# Altium project momiu_01.PrjPcb
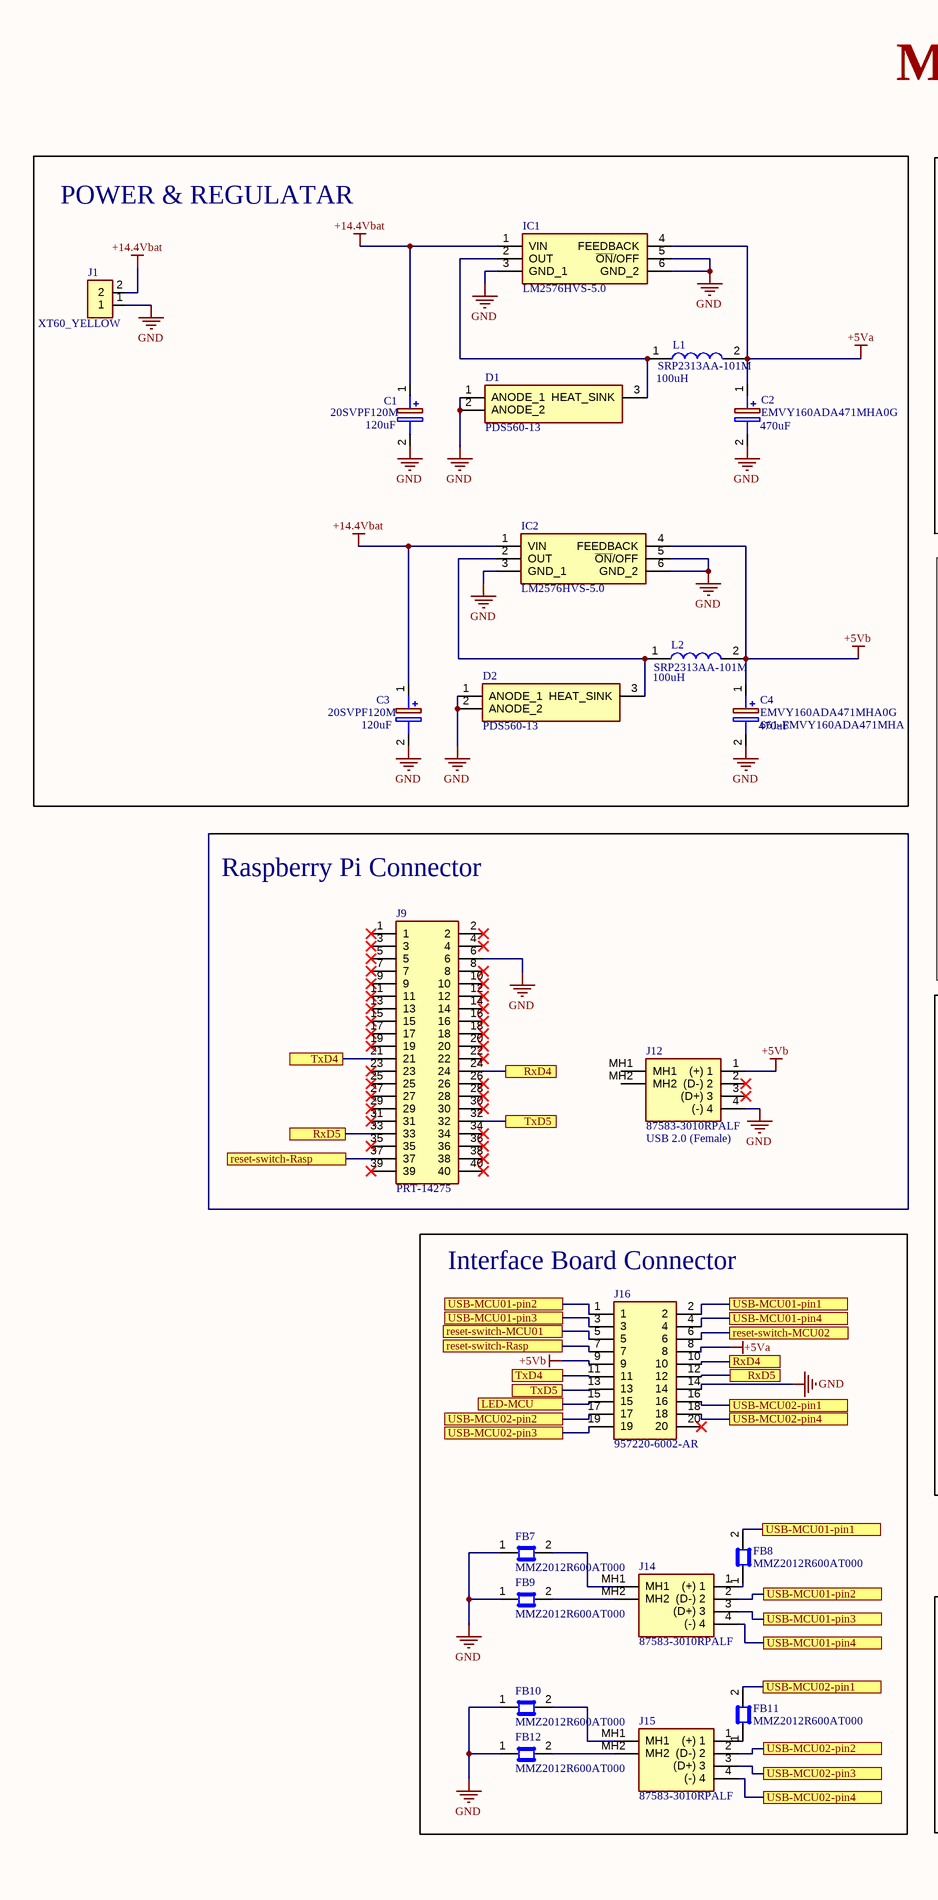
[diagram p0: [03] - MAIN BOARD MOMIU SCHEMATIC.SchDoc, left]
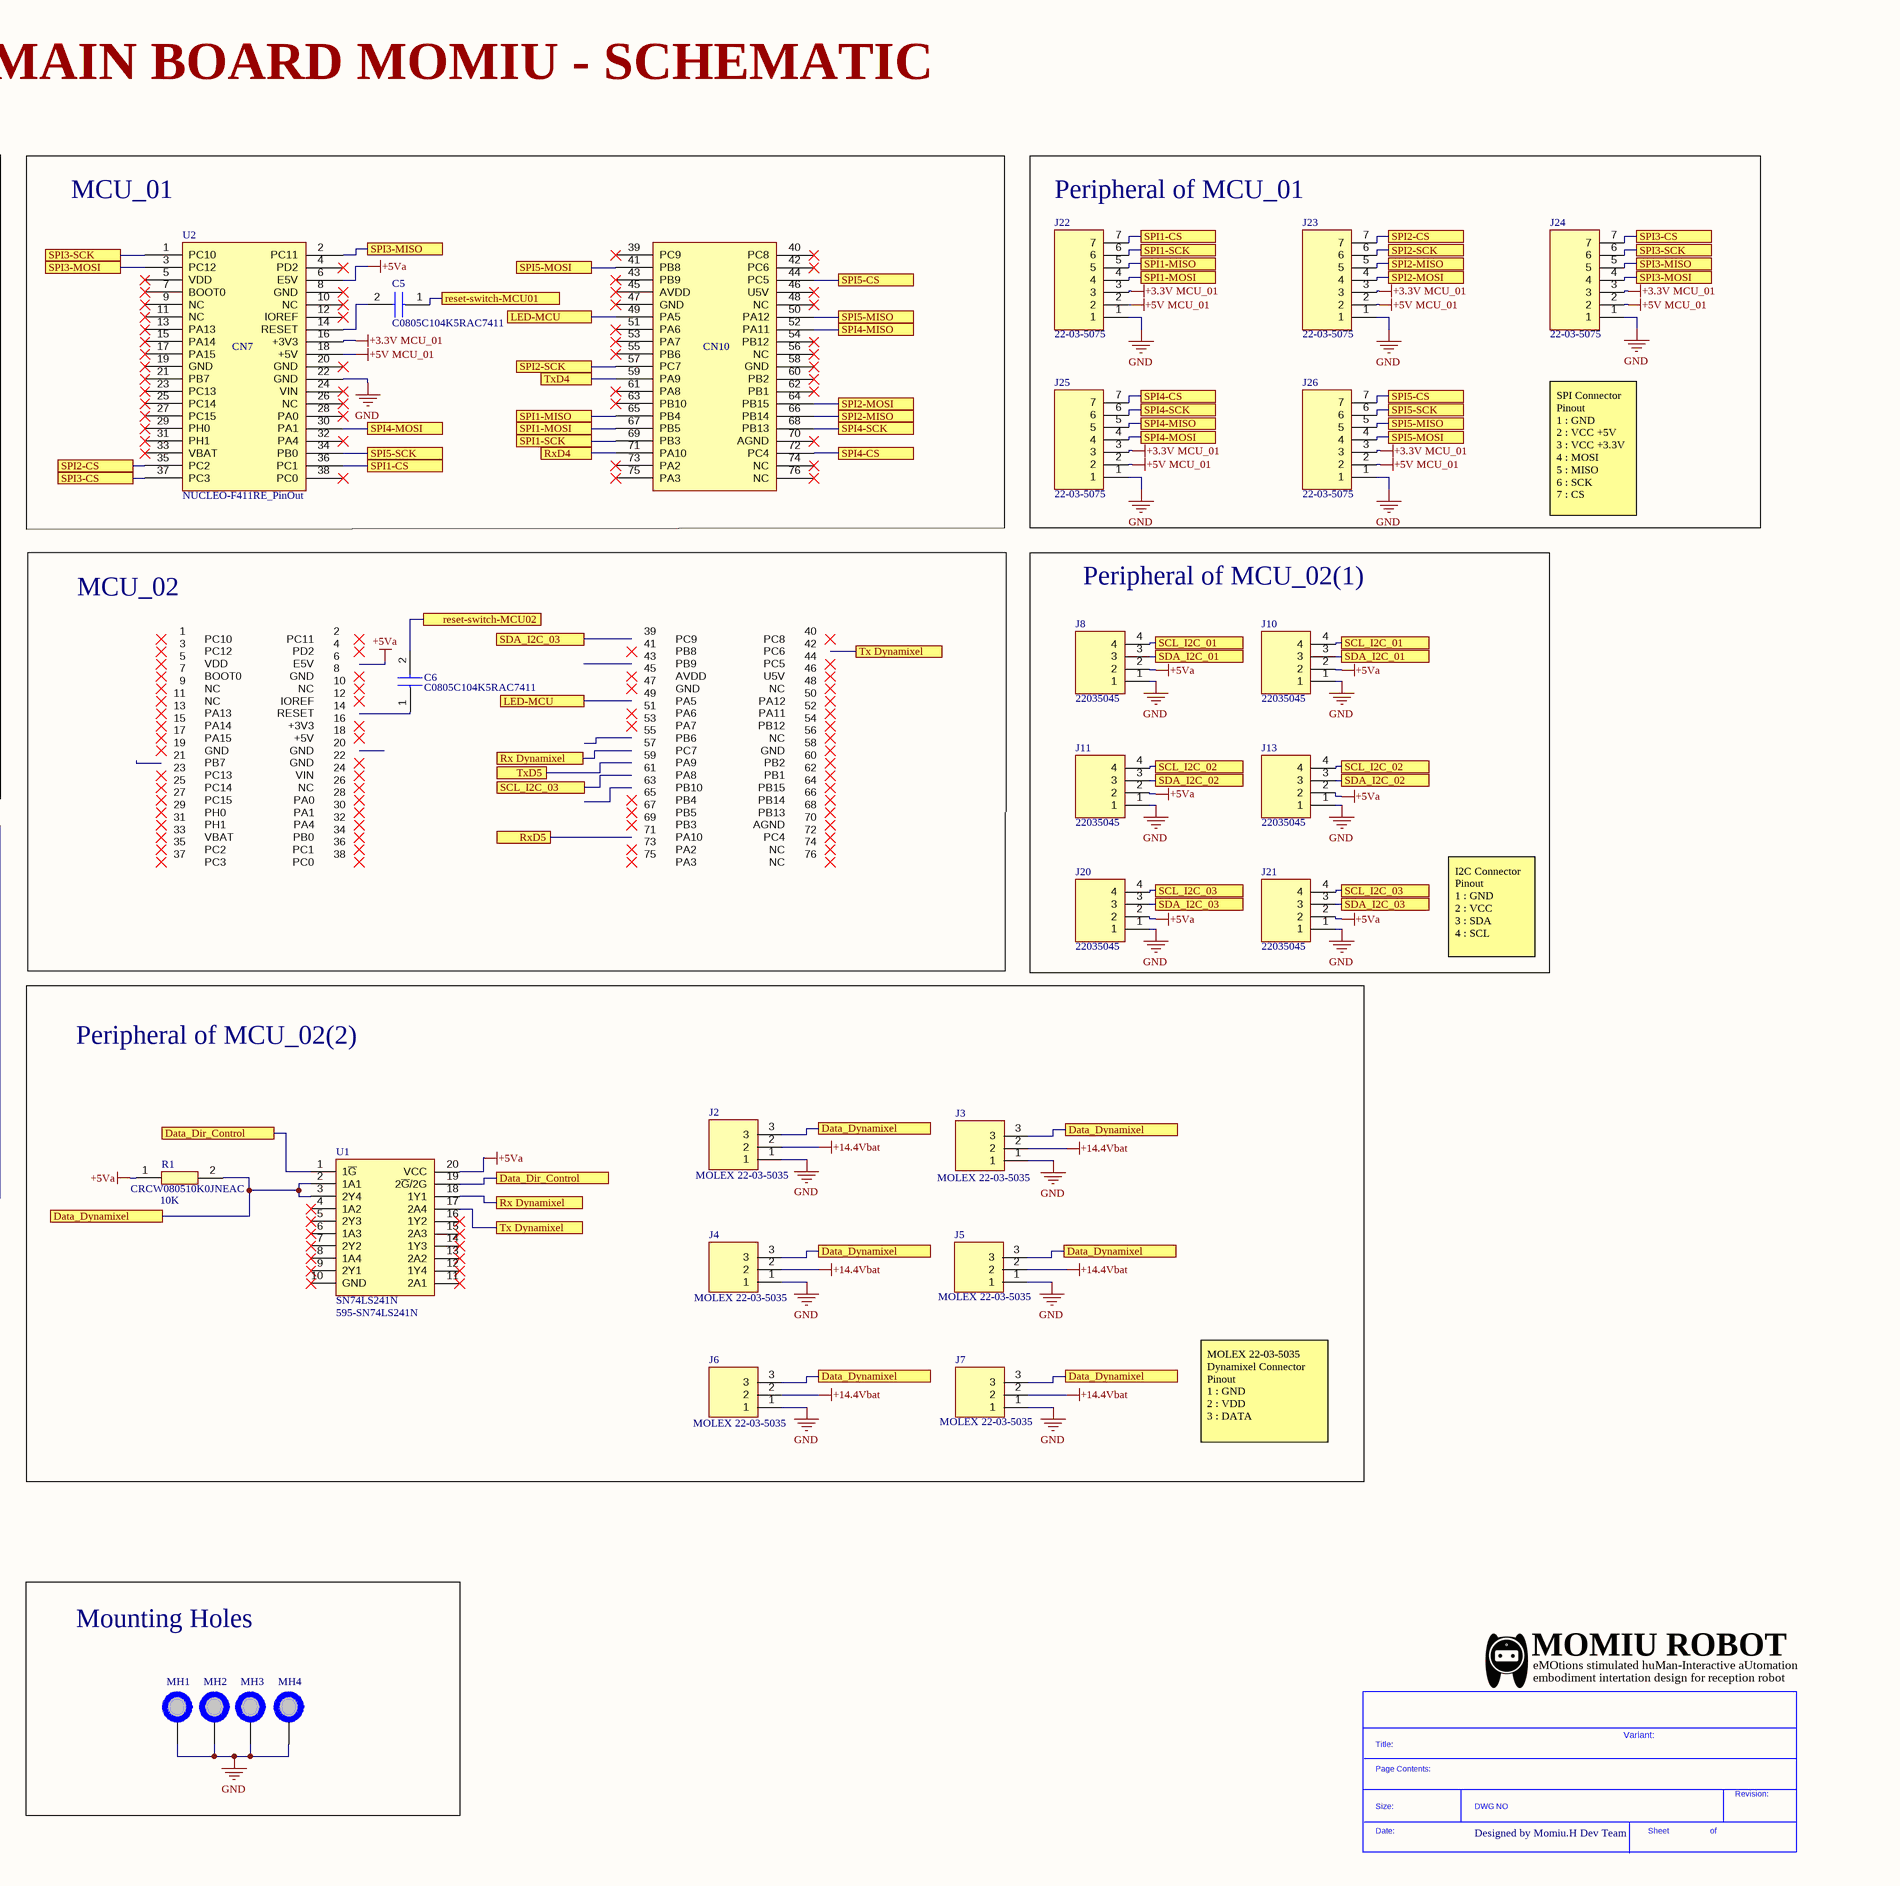
[diagram p1: [03] - MAIN BOARD MOMIU SCHEMATIC.SchDoc, right]
VersionRevision: V1; Title: MOMIU ROBOT-CIRCUIT; Size: -; Project: MOMIU ROBOT; DwgNoMomiu: 1; Company: (C) 2020 MOMIU.H Dev Team
1 sheet, 50 parts. Net scope: flat (ports and power ports of the same name join across sheets).
Board files: PCB_MAIN-BOARD-MOMIU.PcbDoc, PCB_INTERFACE-BOARD-MOMIU.PcbDoc

## Sheet [03] - MAIN BOARD MOMIU SCHEMATIC.SchDoc: MOMIU ROBOT-CIRCUIT
size A2; DocumentNumber: 3; SheetNumber: 3; SheetTotal: 6

### Parts
*?  SDTitleBlock  (value not drawn)  (graphical)
C1  20SVPF120M  [CAPAE660X600N]
C2  EMVY160ADA471MHA0G  [CAPAE830X1050N]
C3  20SVPF120M  [CAPAE660X600N]
C4  EMVY160ADA471MHA0G  Supplier Part Number 1: 661-EMVY160ADA471MHA  [CAPAE830X1050N]
C5  C0805C104K5RAC7411  [CAPC2012X88N]
C6  C0805C104K5RAC7411  [CAPC2012X88N]
D1  PDS560-13  [POWERDI5]
D2  PDS560-13  [POWERDI5]
FB7  MMZ2012R600AT000  [CAPC2012X100N]
FB8  MMZ2012R600AT000  [CAPC2012X100N]
FB9  MMZ2012R600AT000  [CAPC2012X100N]
FB10  MMZ2012R600AT000  [CAPC2012X100N]
FB11  MMZ2012R600AT000  [CAPC2012X100N]
FB12  MMZ2012R600AT000  [CAPC2012X100N]
IC1  LM2576HVS-5.0  [KTT0005B]
IC2  LM2576HVS-5.0  [KTT0005B]
J1  XT60_YELLOW  [AMASS_XT60PB-M]
J2  MOLEX 22-03-5035  [SHDR3W60P0X250_1X3_990X490X590P]
J3  MOLEX 22-03-5035  [SHDR3W60P0X250_1X3_990X490X590P]
J4  MOLEX 22-03-5035  [SHDR3W60P0X250_1X3_990X490X590P]
J5  MOLEX 22-03-5035  [SHDR3W60P0X250_1X3_990X490X590P]
J6  MOLEX 22-03-5035  [SHDR3W60P0X250_1X3_990X490X590P]
J7  MOLEX 22-03-5035  [SHDR3W60P0X250_1X3_990X490X590P]
J8  22035045  [SHDR4W70P0X250_1X4_1240X490X610P]
J9  PRT-14275  [HDRV40W64P254_2X20_5080X500X884P]
J10  22035045  [SHDR4W70P0X250_1X4_1240X490X610P]
J11  22035045  [SHDR4W70P0X250_1X4_1240X490X610P]
J12  87583-3010RPALF  [875833010RPALF]
J13  22035045  [SHDR4W70P0X250_1X4_1240X490X610P]
J14  87583-3010RPALF  [875833010RPALF]
J15  87583-3010RPALF  [875833010RPALF]
J16  957220-6002-AR  [9572206002AR]
J20  22035045  [SHDR4W70P0X250_1X4_1240X490X610P]
J21  22035045  [SHDR4W70P0X250_1X4_1240X490X610P]
J22  22-03-5075  [SHDR7W70P0X250_1X7_1990X490X590P]
J23  22-03-5075  [SHDR7W70P0X250_1X7_1990X490X590P]
J24  22-03-5075  [SHDR7W70P0X250_1X7_1990X490X590P]
J25  22-03-5075  [SHDR7W70P0X250_1X7_1990X490X590P]
J26  22-03-5075  [SHDR7W70P0X250_1X7_1990X490X590P]
L1  SRP2313AA-101M  [INDPM235220X1300N]
L2  SRP2313AA-101M  [INDPM235220X1300N]
MH1  MH_7.4 MMC_3.2 MMD  [MH_7.4 MMC_3.2 MMD]  (value not drawn)  (no BOM)
MH2  MH_7.4 MMC_3.2 MMD  [MH_7.4 MMC_3.2 MMD]  (value not drawn)  (no BOM)
MH3  MH_7.4 MMC_3.2 MMD  [MH_7.4 MMC_3.2 MMD]  (value not drawn)  (no BOM)
MH4  MH_7.4 MMC_3.2 MMD  [MH_7.4 MMC_3.2 MMD]  (value not drawn)  (no BOM)
R1  CRCW080510K0JNEAC  [RESC2012X60N]
U1  SN74LS241N  Supplier Part Number 1: 595-SN74LS241N  [DIP794W53P254L2540H508Q20N]
U2  NUCLEO-F411RE_PinOut  [ST_NUCLEO-F411RE]
U3  NUCLEO-F411RE_PinOut  [ST_NUCLEO-F411RE]

### Blocks framed on the sheet
POWER & REGULATAR: C1-C4 D1 D2 IC1 IC2 J1 L1 L2
MCU_01: C5 U2
Peripheral of MCU_01: J22-J26
Peripheral of MCU_02(1): J8 J10 J11 J13 J20 J21
Peripheral of MCU_02(2): J2-J7 R1 U1
Interface Board Connector: FB7-FB12 J14-J16
Mounting Holes: MH1-MH4

### Ports
Data_Dir_Control, Data_Dynamixel, LED-MCU, reset-switch-MCU01, reset-switch-MCU02, reset-switch-Rasp, Rx Dynamixel, RxD4, RxD5, SCL_I2C_01, SCL_I2C_02, SCL_I2C_03, SDA_I2C_01, SDA_I2C_02, SDA_I2C_03, SPI1-CS, SPI1-MISO, SPI1-MOSI, SPI1-SCK, SPI2-CS, SPI2-MISO, SPI2-MOSI, SPI2-SCK, SPI3-CS, SPI3-MISO, SPI3-MOSI, SPI3-SCK, SPI4-CS, SPI4-MISO, SPI4-MOSI, SPI4-SCK, SPI5-CS, SPI5-MISO, SPI5-MOSI, SPI5-SCK, Tx Dynamixel, TxD4, TxD5, USB-MCU01-pin1, USB-MCU01-pin2, USB-MCU01-pin3, USB-MCU01-pin4, USB-MCU02-pin1, USB-MCU02-pin2, USB-MCU02-pin3, USB-MCU02-pin4

### Nets
+3.3V MCU_01: J22.3 J23.3 J24.3 J25.3 J26.3 U2.16(+3V3)
+5V MCU_01: J22.2 J23.2 J24.2 J25.2 J26.2 U2.18(+5V)
+5Va: C2.1(+) IC1.4(FEEDBACK) J8.2 J10.2 J11.2 J13.2 J16.8 J20.2 J21.2 L1.2 R1.1 U1.20(VCC) U2.6(E5V) U3.6(E5V)
+5Vb: C4.1(+) IC2.4(FEEDBACK) J12.1((+)_1) J16.9 L2.2
+14.4Vbat: C1.1(+) C3.1(+) IC1.1(VIN) IC2.1(VIN) J1.2 J2.2 J3.2 J4.2 J5.2 J6.2 J7.2
GND: C1.2(-) C2.2(-) C3.2(-) C4.2(-) D1.1(ANODE_1) D1.2(ANODE_2) D2.1(ANODE_1) D2.2(ANODE_2) FB7.1 FB9.1 FB10.1 FB12.1 IC1.3(GND_1) IC1.5(~{ON}/OFF) IC1.6(GND_2) IC2.3(GND_1) IC2.5(~{ON}/OFF) IC2.6(GND_2) J1.1 J2.1 J3.1 J4.1 J5.1 J6.1 J7.1 J8.1 J9.6 J10.1 J11.1 J12.4((-)_4) J13.1 J16.14 J20.1 J21.1 J22.1 J23.1 J24.1 J25.1 J26.1 MH1.1 MH2.1 MH3.1 MH4.1 U2.22(GND) U3.20(GND)
NetC5_1: C5.1 J16.5 ; port reset-switch-MCU01
NetC5_2: C5.2 U2.14(RESET)
NetC6_1: C6.1 U3.14(RESET)
NetC6_2: C6.2 J16.6 ; port reset-switch-MCU02
NetD1_3: D1.3(HEAT_SINK) IC1.2(OUT) L1.1
NetD2_3: D2.3(HEAT_SINK) IC2.2(OUT) L2.1
NetFB7_2: FB7.2 J14.MH1
NetFB8_1: FB8.1 J14.1((+)_1)
NetFB8_2: FB8.2 J16.2 ; port USB-MCU01-pin1
NetFB9_2: FB9.2 J14.MH2
NetFB10_2: FB10.2 J15.MH1
NetFB11_1: FB11.1 J15.1((+)_1)
NetFB11_2: FB11.2 J16.16 ; port USB-MCU02-pin1
NetFB12_2: FB12.2 J15.MH2
NetJ2_3: J2.3 J3.3 J4.3 J5.3 J6.3 J7.3 R1.2 U1.2(1A1) U1.3(2Y4) ; port Data_Dynamixel
NetJ8_3: J8.3 J10.3 U3.21(PB7) ; port SDA_I2C_01
NetJ8_4: J8.4 J10.4 U3.55(PB6) ; port SCL_I2C_01
NetJ9_21: J9.21 J16.11 U2.59(PA9) ; port TxD4
NetJ9_24: J9.24 J16.10 U2.71(PA10) ; port RxD4
NetJ9_32: J9.32 J16.13 U3.59(PA9) ; port TxD5
NetJ9_33: J9.33 J16.12 U3.71(PA10) ; port RxD5
NetJ9_37: J9.37 J16.7 ; port reset-switch-Rasp
NetJ11_3: J11.3 J13.3 U3.43(PB9) ; port SDA_I2C_02
NetJ11_4: J11.4 J13.4 U3.63(PB10) ; port SCL_I2C_02
NetJ14_2: J14.2((D-)_2) J16.1 ; port USB-MCU01-pin2
NetJ14_3: J14.3((D+)_3) J16.3 ; port USB-MCU01-pin3
NetJ14_4: J14.4((-)_4) J16.4 ; port USB-MCU01-pin4
NetJ15_2: J15.2((D-)_2) J16.17 ; port USB-MCU02-pin2
NetJ15_3: J15.3((D+)_3) J16.19 ; port USB-MCU02-pin3
NetJ15_4: J15.4((-)_4) J16.18 ; port USB-MCU02-pin4
NetJ16_15: J16.15 U2.49(PA5) U3.49(PA5) ; port LED-MCU
NetJ20_3: J20.3 J21.3 U3.39(PC9) ; port SDA_I2C_03
NetJ20_4: J20.4 J21.4 U3.61(PA8) ; port SCL_I2C_03
NetJ22_4: J22.4 U2.67(PB5) ; port SPI1-MOSI
NetJ22_5: J22.5 U2.65(PB4) ; port SPI1-MISO
NetJ22_6: J22.6 U2.69(PB3) ; port SPI1-SCK
NetJ22_7: J22.7 U2.36(PC1) ; port SPI1-CS
NetJ23_4: J23.4 U2.64(PB15) ; port SPI2-MOSI
NetJ23_5: J23.5 U2.66(PB14) ; port SPI2-MISO
NetJ23_6: J23.6 U2.57(PC7) ; port SPI2-SCK
NetJ23_7: J23.7 U2.35(PC2) ; port SPI2-CS
NetJ24_4: J24.4 U2.3(PC12) ; port SPI3-MOSI
NetJ24_5: J24.5 U2.2(PC11) ; port SPI3-MISO
NetJ24_6: J24.6 U2.1(PC10) ; port SPI3-SCK
NetJ24_7: J24.7 U2.37(PC3) ; port SPI3-CS
NetJ25_4: J25.4 U2.30(PA1) ; port SPI4-MOSI
NetJ25_5: J25.5 U2.52(PA11) ; port SPI4-MISO
NetJ25_6: J25.6 U2.68(PB13) ; port SPI4-SCK
NetJ25_7: J25.7 U2.72(PC4) ; port SPI4-CS
NetJ26_4: J26.4 U2.41(PB8) ; port SPI5-MOSI
NetJ26_5: J26.5 U2.50(PA12) ; port SPI5-MISO
NetJ26_6: J26.6 U2.34(PB0) ; port SPI5-SCK
NetJ26_7: J26.7 U2.44(PC5) ; port SPI5-CS
NetU1_1: U1.1(1~{G}) U1.19(2~{G}/2G) ; port Data_Dir_Control
NetU1_17: U1.17(2A4) U3.42(PC6) ; port Tx Dynamixel
NetU1_18: U1.18(1Y1) U3.57(PC7) ; port Rx Dynamixel

Not connected (* = marked no-connect by the designer): J9 1* 2* 3* 4* 5* 7* 8* 9* 10* 11* 12* 13* 14* 15* 16* 17* 18* 19* 20* 22* 23* 25* 26* 27* 28* 29* 30* 31* 34* 35* 36* 38* 39* 40*; J12 2((D-)_2)* 3((D+)_3)* MH1 MH2; J16 20*; U1 4(1A2)* 5(2Y3)* 6(1A3)* 7(2Y2)* 8(1A4)* 9(2Y1)* 10(GND)* 11(2A1)* 12(1Y4)* 13(2A2)* 14(1Y3)* 15(2A3)* 16(1Y2)*; U2 4(PD2)* 5(VDD)* 7(BOOT0)* 8(GND)* 9(NC)* 10(NC)* 11(NC)* 12(IOREF)* 13(PA13)* 15(PA14)* 17(PA15)* 19(GND)* 20(GND)* 21(PB7)* 23(PC13)* 24(VIN)* 25(PC14)* 26(NC)* 27(PC15)* 28(PA0)* 29(PH0)* 31(PH1)* 32(PA4)* 33(VBAT)* 38(PC0)* 39(PC9)* 40(PC8)* 42(PC6)* 43(PB9)* 45(AVDD)* 46(U5V)* 47(GND)* 48(NC)* 51(PA6)* 53(PA7)* 54(PB12)* 55(PB6)* 56(NC)* 58(GND)* 60(PB2)* 61(PA8)* 62(PB1)* 63(PB10)* 70(AGND)* 73(PA2)* 74(NC)* 75(PA3)* 76(NC)*; U3 1(PC10)* 2(PC11)* 3(PC12)* 4(PD2)* 5(VDD)* 7(BOOT0)* 8(GND)* 9(NC)* 10(NC)* 11(NC)* 12(IOREF)* 13(PA13)* 15(PA14)* 16(+3V3)* 17(PA15)* 18(+5V)* 19(GND)* 22(GND)* 23(PC13)* 24(VIN)* 25(PC14)* 26(NC)* 27(PC15)* 28(PA0)* 29(PH0)* 30(PA1)* 31(PH1)* 32(PA4)* 33(VBAT)* 34(PB0)* 35(PC2)* 36(PC1)* 37(PC3)* 38(PC0)* 40(PC8)* 41(PB8)* 44(PC5)* 45(AVDD)* 46(U5V)* 47(GND)* 48(NC)* 50(PA12)* 51(PA6)* 52(PA11)* 53(PA7)* 54(PB12)* 56(NC)* 58(GND)* 60(PB2)* 62(PB1)* 64(PB15)* 65(PB4)* 66(PB14)* 67(PB5)* 68(PB13)* 69(PB3)* 70(AGND)* 72(PC4)* 73(PA2)* 74(NC)* 75(PA3)* 76(NC)*

### Notes on the sheet
- MAIN BOARD MOMIU - SCHEMATIC
- (near C1) 120uF
- (near L1) 100uH
- (near C2) 470uF
- SPI Connector                                                      Pinout                                                                 1 : GND                                                              2 : VCC +5V                                                           3 : VCC +3.3V                                                         4 : MOSI                                                                  5 : MISO                                                                   6 : SCK                                                                   7 : CS
- MCU_02
- (near L2) 100uH
- (near C3) 120uF
- (near C4) 470uF
- Raspberry Pi Connector
- I2C Connector                                                      Pinout                                                                 1 : GND                                                              2 : VCC                                                            3 : SDA                                                               4 : SCL
- (near J12) USB 2.0 (Female)
- (near R1) 10K
- MOLEX 22-03-5035                                         Dynamixel Connector                                        Pinout                                                                  1 : GND                                                                2 : VDD                                                               3 : DATA
- MOMIU ROBOT
- eMOtions stimulated huMan-Interactive aUtomation
- embodiment intertation design for reception robot
- Variant:
- Designed by Momiu.H Dev Team
- DWG NO:
- REV:
- THIS DOCUMENT AND THE DATA DISCLOSED HEREIN OR
- HEREWITH IS THE PROPERTY OF ALTIUM LIMITED AND MAY
- BE FREELY DISTRIBUTED IN WHOLE. NO RIGHTS ARE
- RESERVED OR EXPRESS OR IMPLIED WARANTEE GIVEN.
- REVISION
- DESCRIPTION
- DATE
- APPROVED
- ENG:
- APPROVALS
- PROJECT
- DSN:
- CHK:
- REFERENCE DOCUMENTS
- PROJECT REVISION:
- TITLE
- DOCUMENT REVISION:
- DESIGN ITEM:
- BOM:
- FAB DWG:
- PCB DWG:
- ASSY DWG:
- SCALE:
- A2
- SIZE
- CAGE CODE
- FILE NAME
- DWG NO.
- SHEET
- OF
- REV
- (in symbol NUCLEO-F411RE_MyVer) CN7; CN10
- (in symbol SDTitleBlock) Title:; Page Contents:; Revision:; Size:; DWG NO; Date:; Sheet; of

### Library data of the parts
C1 C3 = 20SVPF120M: Capacitor Polarised; Manufacturer_Name: Panasonic; Datasheet Link: https://industrial.panasonic.com/cdbs/www-data/pdf/AAB8000/AAB8000C177.pdf; Height: 6mm; Manufacturer_Part_Number: 20SVPF120M; Mouser Part Number: 667-20SVPF120M; Mouser Price/Stock: https://www.mouser.co.uk/ProductDetail/Panasonic/20SVPF120M/?qs=OE1iw1LrrPFAGQZp2uLmXQ%3D%3D; Arrow Part Number: 20SVPF120M; Arrow Price/Stock: https://www.arrow.com/en/products/20svpf120m/panasonic; Supplier 1: Mouser; Supplier Part Number 1: 667-20SVPF120M
C2 C4 = EMVY160ADA471MHA0G: Capacitor Polarised; Manufacturer_Name: United Chemi-Con; Datasheet Link: https://componentsearchengine.com/Datasheets/1/EMVY160ADA471MHA0G.pdf; Height: 10.5mm; Manufacturer_Part_Number: EMVY160ADA471MHA0G; Mouser Part Number: 661-EMVY160ADA471MHA; Mouser Price/Stock: https://www.mouser.com/Search/Refine.aspx?Keyword=661-EMVY160ADA471MHA; Arrow Part Number: EMVY160ADA471MHA0G; Arrow Price/Stock: https://www.arrow.com/en/products/emvy160ada471mha0g/united-chemi-con; Supplier 1: Mouser
  C2: Supplier Part Number 1: 661-EMVY160ADA471MHA
C5 C6 = C0805C104K5RAC7411: Capacitor; Manufacturer_Name: Kemet; Datasheet Link: https://www.mouser.com/datasheet/2/212/KEM_C1002_X7R_SMD-1102033.pdf; Height: 0.88mm; Manufacturer_Part_Number: C0805C104K5RAC7411; Mouser Part Number: 80-C0805C104K5RACLR; Mouser Price/Stock: https://www.mouser.co.uk/ProductDetail/KEMET/C0805C104K5RAC7411?qs=jbRM9o5BbzPcVXF0wW9AYg%3D%3D; Arrow Part Number: C0805C104K5RAC7411; Arrow Price/Stock: https://www.arrow.com/en/products/c0805c104k5rac7411/kemet-corporation; Supplier 1: Mouser; Supplier Part Number 1: 80-C0805C104K5RACLR
D1 D2 = PDS560-13: Diode; Manufacturer_Name: Diodes Inc.; Datasheet Link: http://uk.rs-online.com/web/p/products/7514685; Manufacturer_Part_Number: PDS560-13; Mouser Part Number: 621-PDS560-F; Mouser Price/Stock: https://www.mouser.co.uk/ProductDetail/Diodes-Incorporated/PDS560-13?qs=%2FNF5U5UGuWkl3I91y%252BsKBg%3D%3D; Arrow Part Number: PDS560-13; Arrow Price/Stock: https://www.arrow.com/en/products/pds560-13/diodes-incorporated; Supplier 1: Mouser; Supplier Part Number 1: 621-PDS560-F
FB7-FB12 = MMZ2012R600AT000: Ferrite Beads 60 OHM 25% @100 MHz; Supplier 1: Mouser; Supplier Part Number 1: 810-MMZ2012R600AT000
IC1 IC2 = LM2576HVS-5.0: Integrated Circuit; Manufacturer_Name: Texas Instruments; Datasheet Link: https://www.arrow.com/en/products/lm2576hvs-5.0/texas-instruments; Manufacturer_Part_Number: LM2576HVS-5.0; Mouser Part Number: 926-LM2576HVS-50; Mouser Price/Stock: https://www.mouser.co.uk/ProductDetail/Texas-Instruments/LM2576HVS-50/?qs=X1J7HmVL2ZGtvFS7GBfMMQ%3D%3D; Arrow Part Number: LM2576HVS-5.0; Arrow Price/Stock: https://www.arrow.com/en/products/lm2576hvs-5.0/texas-instruments; Supplier 1: Mouser; Supplier Part Number 1: 926-LM2576HVS5.0NOPB
J1 = XT60_YELLOW: Power connector; 65A; PIN: 2; Colour: yellow; MP: XT60 YELLOW; MF: Pololu; Package: None; SnapEDA_Link: https://www.snapeda.com/parts/XT60%20YELLOW/Pololu/view-part/423230/?ref=snap; Availability: Unavailable; Price: None; Value: *
J2-J7 = 22-03-5035: Connector; Datasheet Link: http://www.molex.com/pdm_docs/sd/022035035_sd.pdf; Height: 5.9mm; Manufacturer_Name: Molex; Manufacturer_Part_Number: 22-03-5035; Mouser Part Number: 538-22-03-5035; Mouser Price/Stock: https://www.mouser.co.uk/ProductDetail/Molex/22-03-5035?qs=VKrXD49J9Ep%252Bv2WwbOoiPA%3D%3D; Supplier 1: Mouser; Supplier Part Number 1: 538-22-03-5035
J8 J10 J11 J13 J20 J21 = 22035045: Connector; Manufacturer_Name: Molex; Datasheet Link: https://www.molex.com/pdm_docs/sd/022035045_sd.pdf; Height: 6.1mm; Manufacturer_Part_Number: 22035045; Arrow Part Number: 22035045; Arrow Price/Stock: http://www.arrow.com/en/products/22035045/molex; Supplier 1: Mouser; Supplier Part Number 1: 538-22-03-5045
J9 = PRT-14275: Connector; Manufacturer_Name: SparkFun; Datasheet Link: https://componentsearchengine.com/Datasheets/1/PRT-14275.pdf; Height: 8.84mm; Manufacturer_Part_Number: PRT-14275; Mouser Part Number: 474-PRT-14275; Mouser Price/Stock: https://www.mouser.co.uk/ProductDetail/SparkFun/PRT-14275/?qs=YCa%2FAAYMW01SLG%2FRsDUFug%3D%3D; Arrow Part Number: PRT-14275; Arrow Price/Stock: https://www.arrow.com/en/products/prt-14275/sparkfun-electronics; Supplier 1: Mouser; Supplier Part Number 1: 474-PRT-14275
J12 J14 J15 = 87583-3010RPALF: Connector; Manufacturer_Name: Amphenol; Datasheet Link: https://cdn.amphenol-icc.com/media/wysiwyg/files/drawing/87583.pdf; Height: 8.12mm; Manufacturer_Part_Number: 87583-3010RPALF; Mouser Part Number: 649-87583-3010RPALF; Mouser Price/Stock: https://www.mouser.co.uk/ProductDetail/Amphenol-FCI/87583-3010RPALF/?qs=nBv%252BRDKgYU12SV7JkWVR7Q%3D%3D; Arrow Part Number: 87583-3010RPALF; Arrow Price/Stock: https://www.arrow.com/en/products/87583-3010rpalf/amphenol-fci; Supplier 1: Mouser; Supplier Part Number 1: 649-87583-3010RPALF
J16 = 957220-6002-AR: Connector; Manufacturer_Name: 3M; Datasheet Link: http://multimedia.3m.com/mws/media/1400507O/3m-box-header-957-series-78-5100-2656-6.pdf; Height: 5.8mm; Manufacturer_Part_Number: 957220-6002-AR; Mouser Part Number: 517-957220-6002-AR; Mouser Price/Stock: https://www.mouser.co.uk/ProductDetail/3M-Electronic-Solutions-Division/957220-6002-AR?qs=g1avbHDutKUCo0RviEjKSg%3D%3D; Arrow Part Number: 957220-6002-AR; Arrow Price/Stock: https://www.arrow.com/en/products/957220-6002-ar/3m; Supplier 1: Mouser; Supplier Part Number 1: 517-957220-6002-AR
J22-J26 = 22-03-5075: Connector; Manufacturer_Name: Molex; Datasheet Link: https://componentsearchengine.com/Datasheets/1/22-03-5075.pdf; Height: 5.9mm; Manufacturer_Part_Number: 22-03-5075; Mouser Part Number: 538-22-03-5075; Mouser Price/Stock: https://www.mouser.co.uk/ProductDetail/Molex/22-03-5075?qs=4hg9R9g9MDvXfItj0edHKA%3D%3D; Supplier 1: Mouser; Supplier Part Number 1: 538-22-03-5075
L1 L2 = SRP2313AA-101M: Inductor; Manufacturer_Name: Bourns; Datasheet Link: https://th.mouser.com/datasheet/2/54/srp2313aa-1391616.pdf; Height: 13mm; Manufacturer_Part_Number: SRP2313AA-101M; Mouser Part Number: 652-SRP2313AA-101M; Mouser Price/Stock: https://www.mouser.co.uk/ProductDetail/Bourns/SRP2313AA-101M?qs=gZXFycFWdANfITbqx%252BPtOw%3D%3D; Arrow Part Number: SRP2313AA-101M; Arrow Price/Stock: https://www.arrow.com/en/products/srp2313aa-101m/bourns; Supplier 1: Mouser; Supplier Part Number 1: 652-SRP2313AA-330M
MH1-MH4 = MH_7.4MMC_3.2MMD: Mounting Hole 7.4mm Diameter, 3.2mm Drill
R1 = CRCW080510K0JNEAC: Resistor; Manufacturer_Name: Vishay; Datasheet Link: https://componentsearchengine.com/Datasheets/1/CRCW080510K0JNEAC.pdf; Height: 0.6mm; Manufacturer_Part_Number: CRCW080510K0JNEAC; Mouser Part Number: 71-CRCW080510K0JNEAC; Mouser Price/Stock: https://www.mouser.co.uk/ProductDetail/Vishay-Dale/CRCW080510K0JNEAC?qs=E3Y5ESvWgWO0MOXy5ngfMA%3D%3D; Arrow Part Number: CRCW080510K0JNEAC; Arrow Price/Stock: https://www.arrow.com/en/products/crcw080510k0jneac/vishay; Supplier 1: Mouser; Supplier Part Number 1: 71-CRCW0805J-10K-E3
U1 = SN74LS241N: Integrated Circuit; Manufacturer_Name: Texas Instruments; Datasheet Link: http://www.ti.com/lit/gpn/sn74ls241; Height: 5.08mm; Manufacturer_Part_Number: SN74LS241N; Mouser Part Number: 595-SN74LS241N; Mouser Price/Stock: https://www.mouser.co.uk/ProductDetail/Texas-Instruments/SN74LS241N?qs=tJ5HNKWh3OV6ot2H0B4Gfg%3D%3D; Arrow Part Number: SN74LS241N; Arrow Price/Stock: https://www.arrow.com/en/products/sn74ls241n/texas-instruments; Supplier 1: Mouser
U2 U3 = NUCLEO-F411RE_MyVer